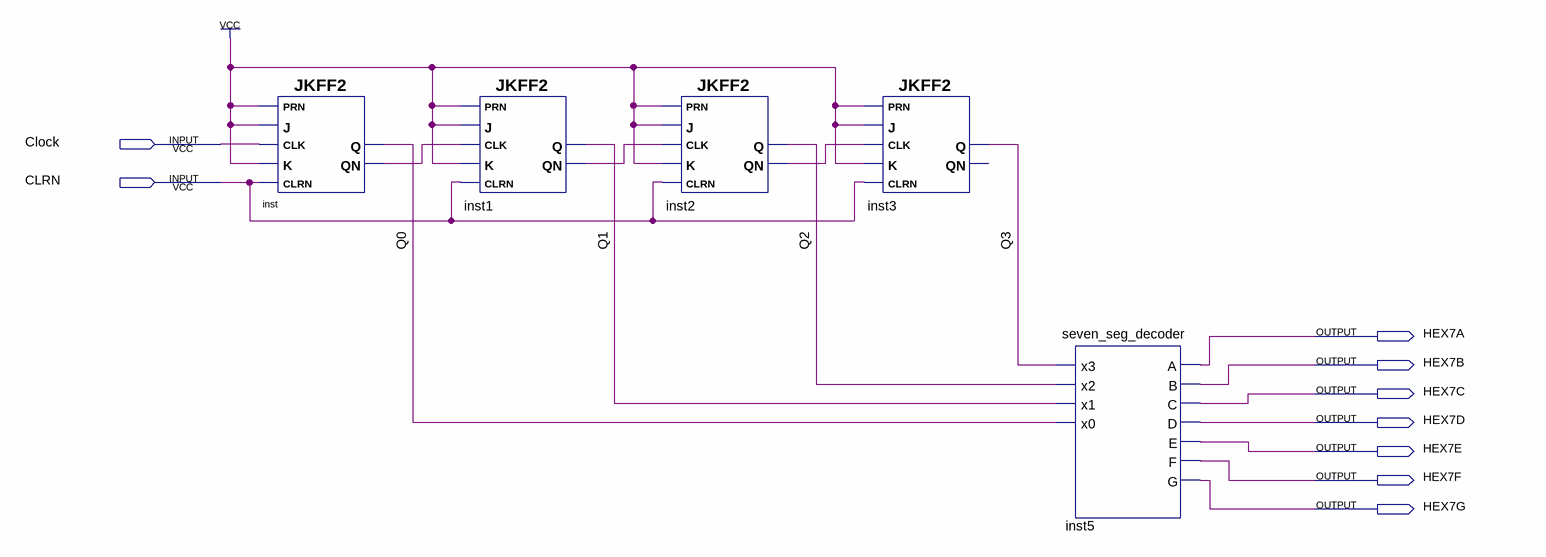
[diagram p0: schematic sheet]
// Quartus schematic lab10step3a.bdf as structural Verilog: 5 symbols, 9 pins
module lab10step3a (
  input  Clock,
  input  CLRN,
  output HEX7A,
  output HEX7B,
  output HEX7C,
  output HEX7D,
  output HEX7E,
  output HEX7F,
  output HEX7G
);

  wire inst1_qn, inst2_qn, inst_qn, Q0, Q1, Q2, Q3;

  JKFF2 inst (.K(1'b1), .CLRN(CLRN), .CLK(Clock), .PRN(1'b1), .J(1'b1), .QN(inst_qn), .Q(Q0));
  JKFF2 inst1 (.K(1'b1), .CLRN(CLRN), .CLK(inst_qn), .PRN(1'b1), .J(1'b1), .QN(inst1_qn), .Q(Q1));
  JKFF2 inst2 (.K(1'b1), .CLRN(CLRN), .CLK(inst1_qn), .PRN(1'b1), .J(1'b1), .QN(inst2_qn), .Q(Q2));
  JKFF2 inst3 (.K(1'b1), .CLRN(CLRN), .CLK(inst2_qn), .PRN(1'b1), .J(1'b1), .Q(Q3));  // open: QN
  seven_seg_decoder inst5 (
    .x3(Q3), .x2(Q2), .x1(Q1), .x0(Q0), .A(HEX7A), .B(HEX7B), .C(HEX7C), .D(HEX7D), .E(HEX7E), .F(HEX7F),
    .G(HEX7G));
endmodule
